# Altium schematic sheet 6路电磁.SchDoc
size A3
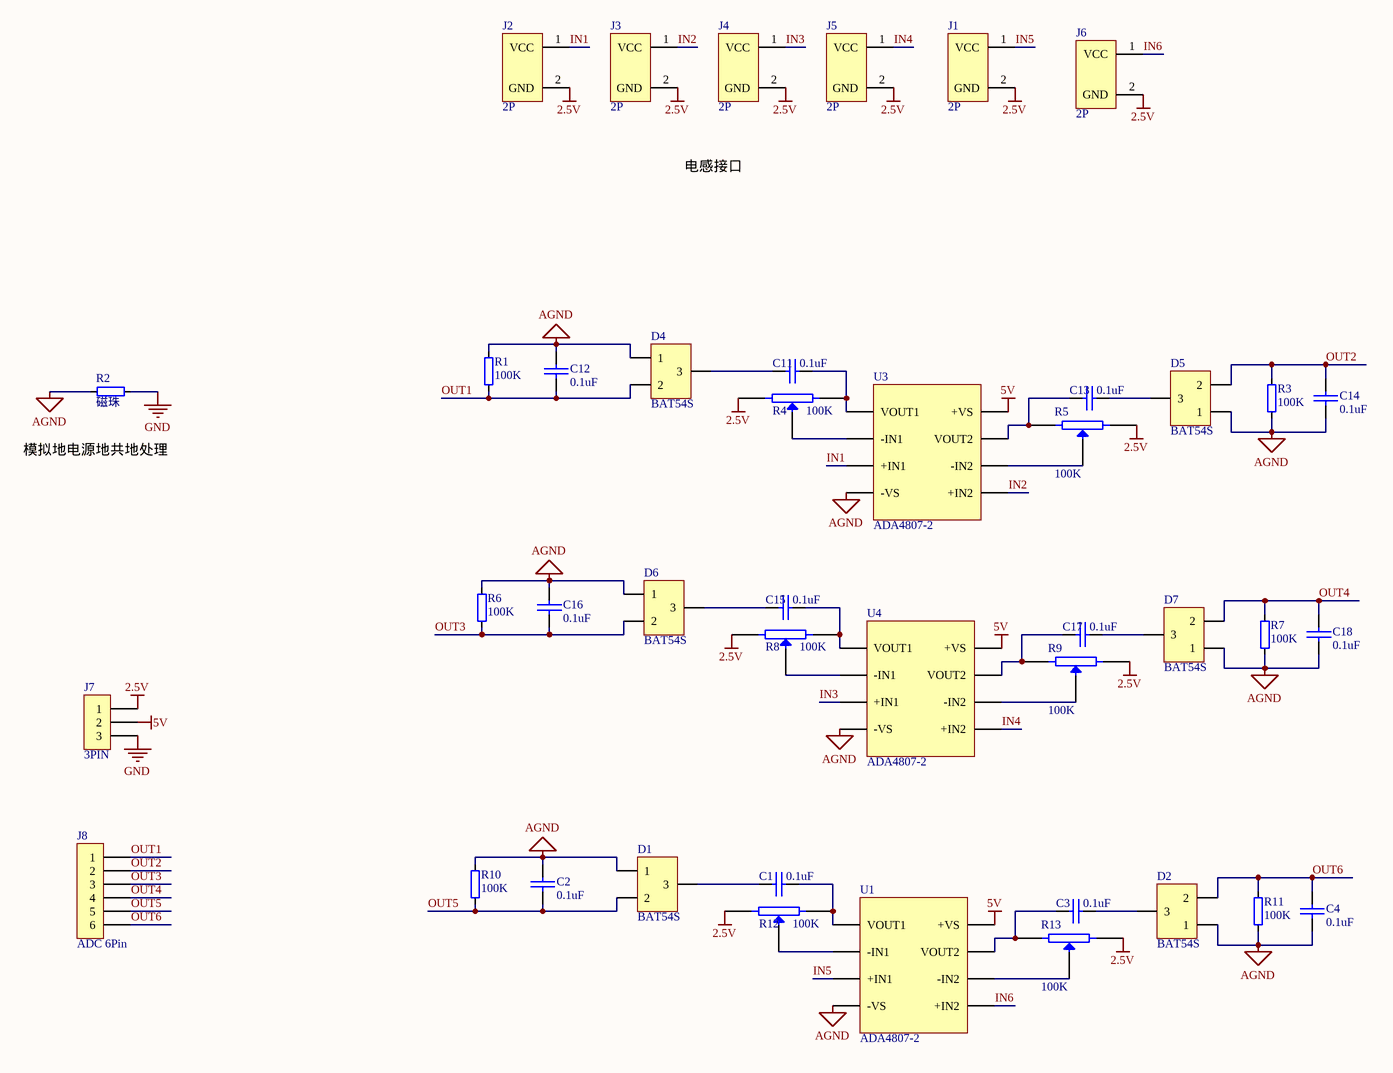
[diagram p0: 6路电磁.SchDoc]

## Parts
C1  0.1uF  [C0603]
C2  0.1uF  [C0603]
C3  0.1uF  [C0603]
C4  0.1uF  [C0603]
C11  0.1uF  [C0603]
C12  0.1uF  [C0603]
C13  0.1uF  [C0603]
C14  0.1uF  [C0603]
C15  0.1uF  [C0603]
C16  0.1uF  [C0603]
C17  0.1uF  [C0603]
C18  0.1uF  [C0603]
D1  BAT54S  [SOT-23]
D2  BAT54S  [SOT-23]
D4  BAT54S  [SOT-23]
D5  BAT54S  [SOT-23]
D6  BAT54S  [SOT-23]
D7  BAT54S  [SOT-23]
J1  2P  [Header-2pin]
J2  2P  [Header-2pin]
J3  2P  [Header-2pin]
J4  2P  [Header-2pin]
J5  2P  [Header-2pin]
J6  2P  [Header-2pin]
J7  3PIN  [3PIN]
J8  ADC 6Pin  [ADC 6Pin]
R1  100K  [R0603]
R2  磁珠  [R0603]
R3  100K  [R0603]
R4  100K  [电位器]
R5  100K  [电位器]
R6  100K  [R0603]
R7  100K  [R0603]
R8  100K  [电位器]
R9  100K  [电位器]
R10  100K  [R0603]
R11  100K  [R0603]
R12  100K  [电位器]
R13  100K  [电位器]
U1  ADA4807-2  [AD8217]
U3  ADA4807-2  [AD8217]
U4  ADA4807-2  [AD8217]

## Nets
2.5V: J1.2(GND) J2.2(GND) J3.2(GND) J4.2(GND) J5.2(GND) J6.2(GND) J7.1 R4.3 R5.1 R8.3 R9.1 R12.3 R13.1
5V: J7.2 U1.8(+VS) U3.8(+VS) U4.8(+VS)
AGND: C2.1 C4.2 C12.1 C14.2 C16.1 C18.2 D1.1 D2.1 D4.1 D5.1 D6.1 D7.1 R1.2 R2.1 R3.1 R6.2 R7.1 R10.2 R11.1 U1.4(-VS) U3.4(-VS) U4.4(-VS)
GND: J7.3 R2.2
IN1: J2.1(VCC) U3.3(+IN1)
IN2: J3.1(VCC) U3.5(+IN2)
IN3: J4.1(VCC) U4.3(+IN1)
IN4: J5.1(VCC) U4.5(+IN2)
IN5: J1.1(VCC) U1.3(+IN1)
IN6: J6.1(VCC) U1.5(+IN2)
OUT1: C12.2 D4.2 J8.1 R1.1
OUT2: C14.1 D5.2 J8.2 R3.2
OUT3: C16.2 D6.2 J8.3 R6.1
OUT4: C18.1 D7.2 J8.4 R7.2
OUT5: C2.2 D1.2 J8.5 R10.1
OUT6: C4.1 D2.2 J8.6 R11.2
NetC1_1: C1.1 D1.3
NetC1_2: C1.2 R12.1 U1.1(VOUT1)
NetC3_1: C3.1 R13.3 U1.7(VOUT2)
NetC3_2: C3.2 D2.3
NetC11_1: C11.1 D4.3
NetC11_2: C11.2 R4.1 U3.1(VOUT1)
NetC13_1: C13.1 R5.3 U3.7(VOUT2)
NetC13_2: C13.2 D5.3
NetC15_1: C15.1 D6.3
NetC15_2: C15.2 R8.1 U4.1(VOUT1)
NetC17_1: C17.1 R9.3 U4.7(VOUT2)
NetC17_2: C17.2 D7.3
NetR4_2: R4.2(W) U3.2(-IN1)
NetR5_2: R5.2(W) U3.6(-IN2)
NetR8_2: R8.2(W) U4.2(-IN1)
NetR9_2: R9.2(W) U4.6(-IN2)
NetR12_2: R12.2(W) U1.2(-IN1)
NetR13_2: R13.2(W) U1.6(-IN2)

## Notes on the sheet
- 电感接口
- (near R2) 模拟地电源地共地处理

## Library data of the parts
C1-C4 C11-C18 = MLCC
R1-R3 R6 R7 R10 R11 = RES
R4 R5 R8 R9 R12 R13 = 可调电阻